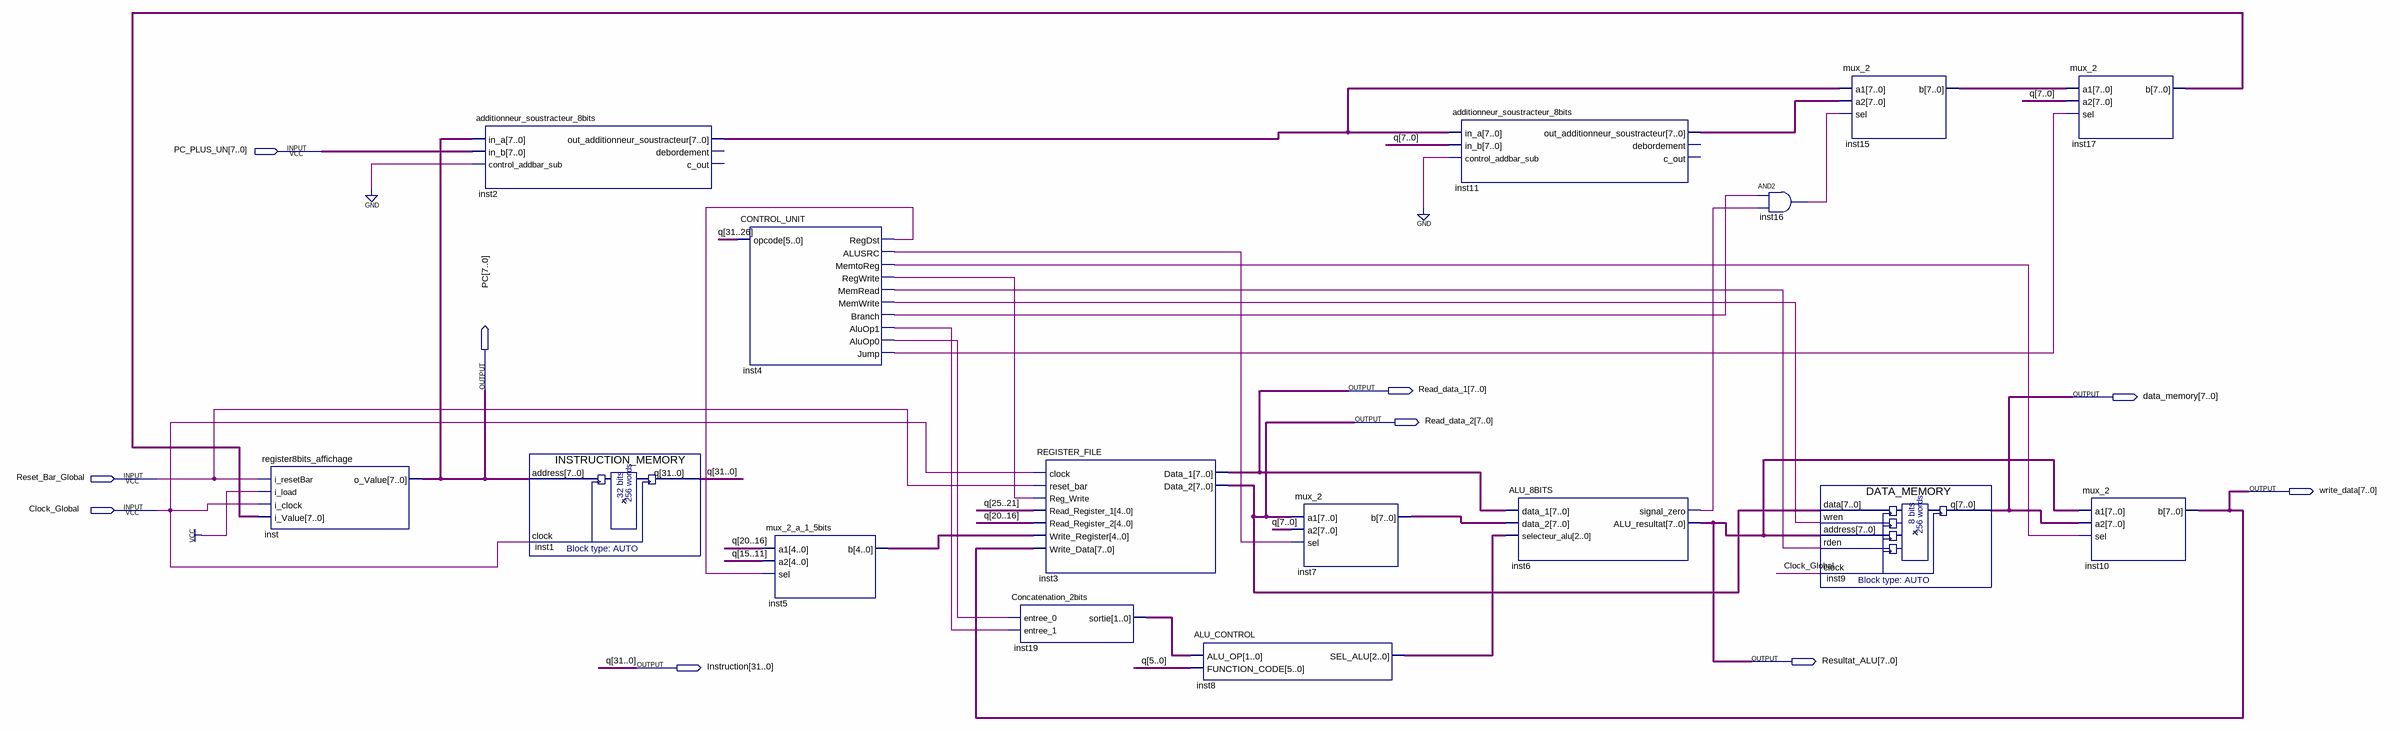
[diagram p0: schematic sheet]
// Quartus schematic Processor_MIPS_diagram.bdf as structural Verilog: 16 symbols, 10 pins
module Processor_MIPS_diagram (
  input  [7:0] PC_PLUS_UN,
  input  Reset_Bar_Global,
  input  Clock_Global,
  output [7:0] PC,
  output [7:0] Read_data_1,
  output [7:0] data_memory,
  output [7:0] Read_data_2,
  output [7:0] write_data,
  output [7:0] Resultat_ALU,
  output [31:0] Instruction
);

  wire inst4_aluop0, inst4_aluop1, inst4_alusrc, inst4_branch, inst4_jump, inst4_memread, inst4_memtoreg,
       inst4_memwrite, inst4_regdst, inst4_regwrite, inst6_signal_zero, inst16_out;
  wire [1:0] inst19_sortie;
  wire [2:0] inst8_sel_alu;
  wire [4:0] inst5_b;
  wire [7:0] inst2_out_additionneur_soustracteur, inst7_b, inst11_out_additionneur_soustracteur, inst15_b,
       inst17_b;

  register8bits_affichage inst (
    .i_resetBar(Reset_Bar_Global), .i_load(1'b1), .i_clock(Clock_Global), .i_Value(inst17_b), .o_Value(PC));
  additionneur_soustracteur_8bits inst2 (
    .in_a(PC), .in_b(PC_PLUS_UN), .control_addbar_sub(1'b0),
    .out_additionneur_soustracteur(inst2_out_additionneur_soustracteur));  // open: debordement, c_out
  INSTRUCTION_MEMORY inst1 (.address(PC), .clock(Clock_Global), .q(Instruction));
  CONTROL_UNIT inst4 (
    .opcode(Instruction[31:26]), .RegDst(inst4_regdst), .ALUSRC(inst4_alusrc), .MemtoReg(inst4_memtoreg),
    .RegWrite(inst4_regwrite), .MemRead(inst4_memread), .MemWrite(inst4_memwrite), .Branch(inst4_branch),
    .AluOp1(inst4_aluop1), .AluOp0(inst4_aluop0), .Jump(inst4_jump));
  mux_2_a_1_5bits inst5 (.a1(Instruction[20:16]), .a2(Instruction[15:11]), .sel(inst4_regdst), .b(inst5_b));
  Concatenation_2bits inst19 (.entree_0(inst4_aluop0), .entree_1(inst4_aluop1), .sortie(inst19_sortie));
  REGISTER_FILE inst3 (
    .clock(Clock_Global), .reset_bar(Reset_Bar_Global), .Reg_Write(inst4_regwrite),
    .Read_Register_1(Instruction[25:21]), .Read_Register_2(Instruction[20:16]), .Write_Register(inst5_b),
    .Write_Data(write_data), .Data_1(Read_data_1), .Data_2(Read_data_2));
  ALU_CONTROL inst8 (.ALU_OP(inst19_sortie), .FUNCTION_CODE(Instruction[5:0]), .SEL_ALU(inst8_sel_alu));
  mux_2 inst7 (.a1(Read_data_2), .a2(Instruction[7:0]), .sel(inst4_alusrc), .b(inst7_b));
  additionneur_soustracteur_8bits inst11 (
    .in_a(inst2_out_additionneur_soustracteur), .in_b(Instruction[7:0]), .control_addbar_sub(1'b0),
    .out_additionneur_soustracteur(inst11_out_additionneur_soustracteur));  // open: debordement, c_out
  ALU_8BITS inst6 (
    .data_1(Read_data_1), .data_2(inst7_b), .selecteur_alu(inst8_sel_alu), .signal_zero(inst6_signal_zero),
    .ALU_resultat(Resultat_ALU));
  and inst16 (inst16_out, inst4_branch, inst6_signal_zero);
  DATA_MEMORY inst9 (
    .data(Read_data_2), .wren(inst4_memwrite), .address(Resultat_ALU), .rden(inst4_memread),
    .clock(Clock_Global), .q(data_memory));
  mux_2 inst15 (
    .a1(inst2_out_additionneur_soustracteur), .a2(inst11_out_additionneur_soustracteur), .sel(inst16_out),
    .b(inst15_b));
  mux_2 inst17 (.a1(inst15_b), .a2(Instruction[7:0]), .sel(inst4_jump), .b(inst17_b));
  mux_2 inst10 (.a1(Resultat_ALU), .a2(data_memory), .sel(inst4_memtoreg), .b(write_data));

  // Other names for the same wires on the sheet: q[31:0] = Instruction
endmodule
